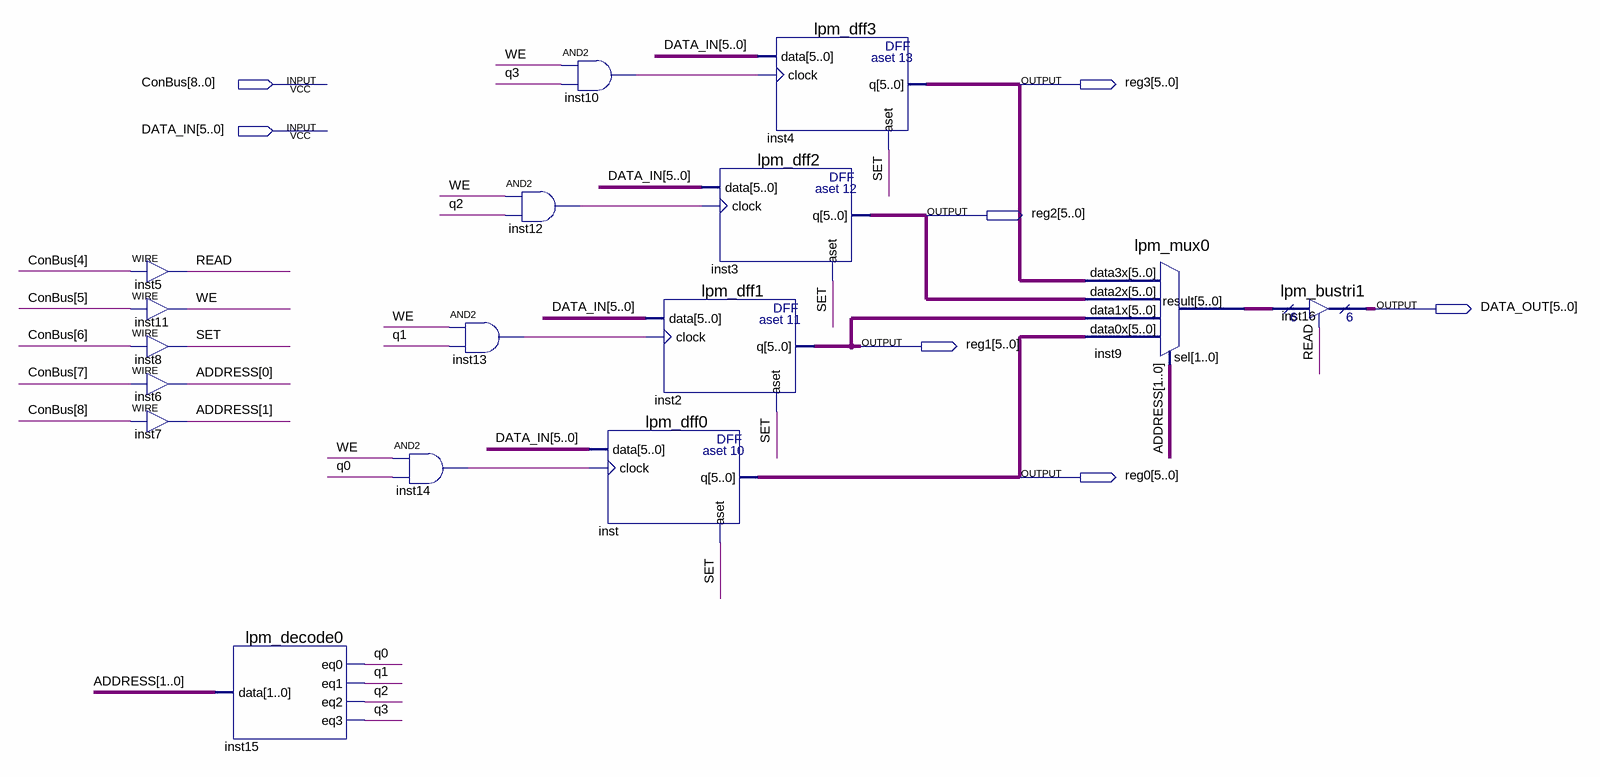
[diagram p0: schematic sheet]
// Quartus schematic ron.bdf as structural Verilog: 16 symbols, 7 pins
module ron (
  input  [8:0] ConBus,
  input  [5:0] DATA_IN,
  output [5:0] reg3,
  output [5:0] reg2,
  output [5:0] DATA_OUT,
  output [5:0] reg1,
  output [5:0] reg0
);

  wire inst10_out, inst12_out, inst13_out, inst14_out, q0, q1, q2, q3, READ, SET, WE;
  wire [1:0] ADDRESS;
  wire [5:0] inst9_result;

  assign READ = ConBus[4];  // WIRE inst5
  assign WE = ConBus[5];  // WIRE inst11
  assign SET = ConBus[6];  // WIRE inst8
  assign ADDRESS[0] = ConBus[7];  // WIRE inst6
  assign ADDRESS[1] = ConBus[8];  // WIRE inst7
  lpm_decode0 inst15 (.data(ADDRESS), .eq0(q0), .eq1(q1), .eq2(q2), .eq3(q3));
  and inst14 (inst14_out, WE, q0);
  and inst12 (inst12_out, WE, q2);
  and inst13 (inst13_out, WE, q1);
  and inst10 (inst10_out, WE, q3);
  lpm_dff1 inst2 (.data(DATA_IN), .clock(inst13_out), .aset(SET), .q(reg1));
  lpm_dff0 inst (.data(DATA_IN), .clock(inst14_out), .aset(SET), .q(reg0));
  lpm_dff2 inst3 (.data(DATA_IN), .clock(inst12_out), .aset(SET), .q(reg2));
  lpm_dff3 inst4 (.data(DATA_IN), .clock(inst10_out), .aset(SET), .q(reg3));
  lpm_mux0 inst9 (.data3x(reg3), .data2x(reg2), .data1x(reg1), .data0x(reg0), .sel(ADDRESS), .result(inst9_result));
  lpm_bustri1 inst16 (.enabledt(READ), .data(inst9_result), .tridata(DATA_OUT));
endmodule
